# Altium schematic sheet Drone Connector.SchDoc
size A4; Organization: Altium Limited; Address1: L3, 12a Rodborough Rd; Address2: Frenchs Forest; Address3: NSW; Address4: Australia 2086; SheetNumber: 1; SheetTotal: 3
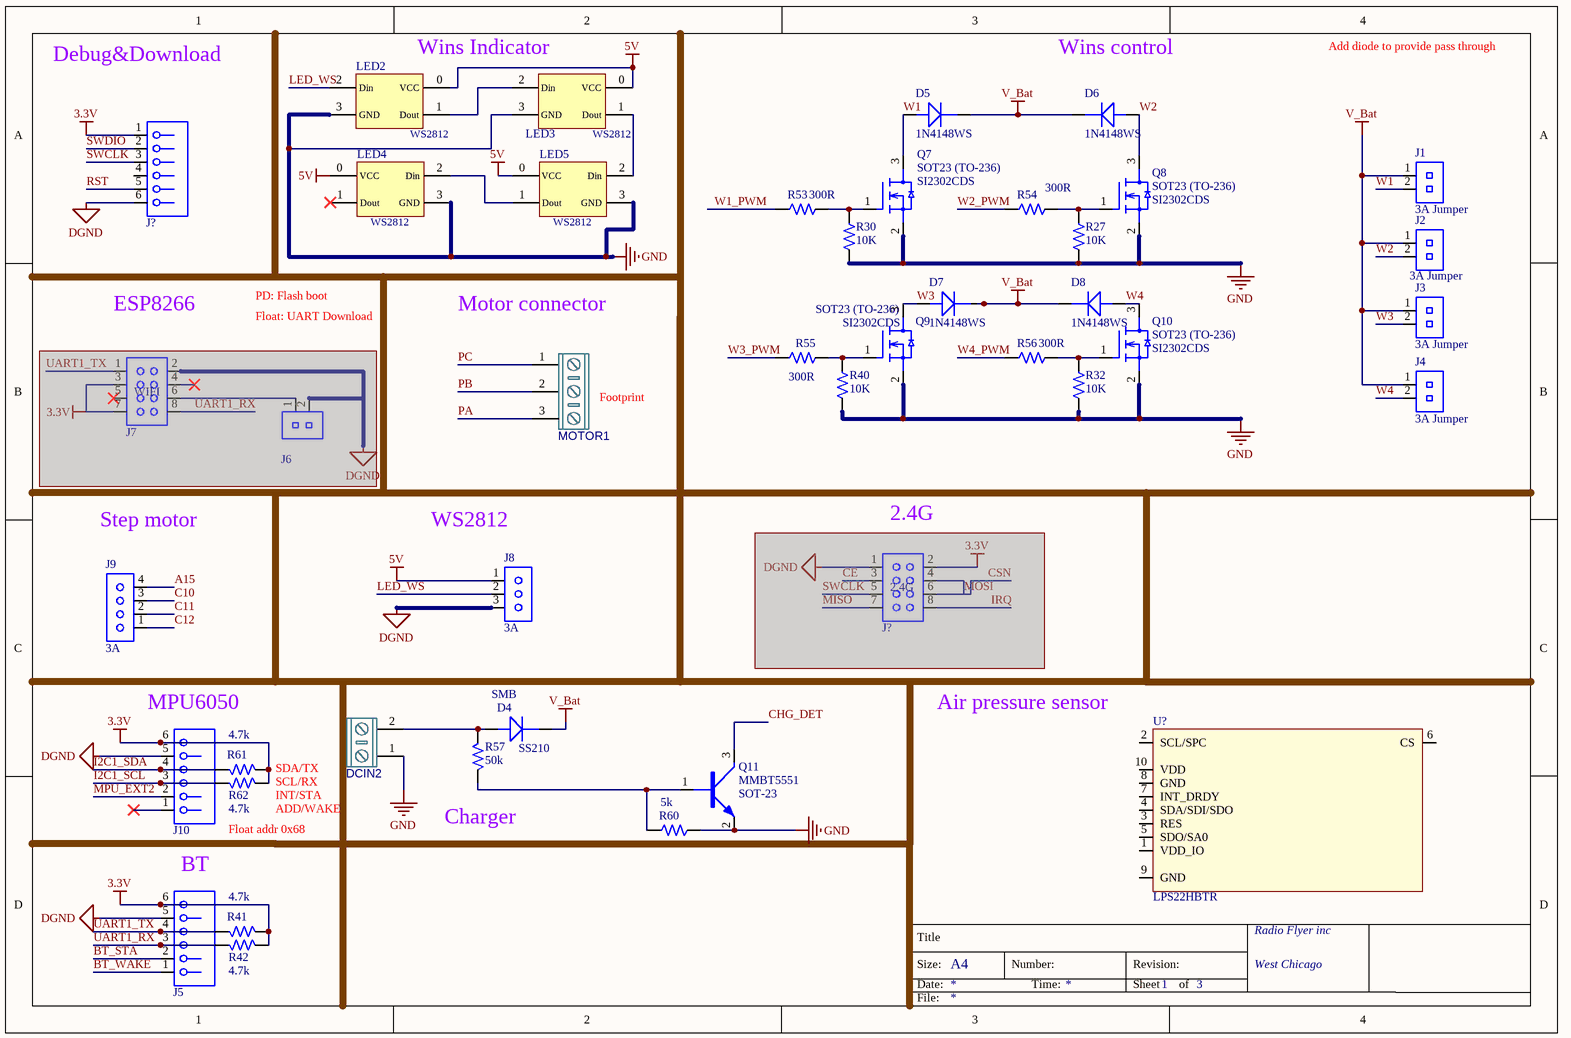
[diagram p0: Drone Connector.SchDoc]

## Parts
(Parts that share a designator on the sheet are numbered #1, #2 ... from top to bottom, then left to right.)
D4  RCD102100-0110  [SMB]  (value not drawn)
D5  RCD114148-0020  [SOD-323]  (value not drawn)
D6  RCD114148-0020  [SOD-323]  (value not drawn)
D7  RCD114148-0020  [SOD-323]  (value not drawn)
D8  RCD114148-0020  [SOD-323]  (value not drawn)
DCIN2  KF/WJ/DG 30x connecter  [KF/WJ/DG 301-2p-5.0mm]  (value not drawn)
J1  Current: 3A Jumper  [HOUSING 2P PH=2.54mm Jumper]  (hidden comment: CCH254020-0102)
J2  Current: 3A Jumper  [HOUSING 2P PH=2.54mm Jumper]  (hidden comment: CCH254020-0102)
J3  Current: 3A Jumper  [HOUSING 2P PH=2.54mm Jumper]  (hidden comment: CCH254020-0102)
J4  Current: 3A Jumper  [HOUSING 2P PH=2.54mm Jumper]  (hidden comment: CCH254020-0102)
J5  T690300121600  [CONN 6P PH=2.5mm RA XHB-6AW-KL]  (value not drawn)
J6  CCH254020-0102  [HOUSING 2P PH=2.54mm Jumper]  (value not drawn)  (masked out: inside a compile mask, not in the netlist)
J7  WIFI  [HEAD 8P 2X4 PH=2.54mm 90 H5mm_2.54-2X4AW-10.4]  (masked out: inside a compile mask, not in the netlist)
J8  Current: 3A  [HEAD 3P PH=2.54mm 180]  (hidden comment: CCP254010-0103)
J9  Current: 3A  [HEAD 4P PH=2.54mm 180]  (hidden comment: CCP254260-0104)
J10  T690300121600  [CONN 6P PH=2.5mm RA XHB-6AW-KL]  (value not drawn)
J?#1  T690300121600  [CONN 6P PH=2.5mm RA XHB-6AW-KL]  (value not drawn)
J?#2  2.4G  [HEAD 8P 2X4 PH=2.54mm 90 H5mm_2.54-2X4AW-10.4]  (masked out: inside a compile mask, not in the netlist)
LED2  WS2812  [WS2812]  (value not drawn)
LED3  WS2812  [WS2812]  (value not drawn)
LED4  WS2812  [WS2812]  (value not drawn)
LED5  WS2812  [WS2812]  (value not drawn)
MOTOR1  KF/WJ/DG 30x connecter  [KF/WJ/DG 301-3p-5.0mm]  (value not drawn)
Q7  Package: SOT23 (TO-236)  [SOT23-132-RW]  (hidden comment: SI2302CDS)
Q8  Package: SOT23 (TO-236)  [SOT23-132-RW]  (hidden comment: SI2302CDS)
Q9  Package: SOT23 (TO-236)  [SOT23-132-RW]  (hidden comment: SI2302CDS)
Q10  Package: SOT23 (TO-236)  [SOT23-132-RW]  (hidden comment: SI2302CDS)
Q11  Package: SOT-23  [SOT23-132-RW]  (hidden comment: RCN005551-0001)
R27  value 10K  [0603-RW]  (hidden comment: T5024421083A9)
R30  value 10K  [0603-RW]  (hidden comment: T5024421083A9)
R32  value 10K  [0603-RW]  (hidden comment: T5024421083A9)
R40  value 10K  [0603-RW]  (hidden comment: T5024421083A9)
R41  value 4.7k  [0603-RW]  (hidden comment: T5024421083A9)
R42  value 4.7k  [0603-RW]  (hidden comment: T5024421083A9)
R53  value 300R  [0603-RW]  (hidden comment: T5024421083A9)
R54  value 300R  [0603-RW]  (hidden comment: T5024421083A9)
R55  value 300R  [0603-RW]  (hidden comment: T5024421083A9)
R56  value 300R  [0603-RW]  (hidden comment: T5024421083A9)
R57  value 50k  [0603-RW]  (hidden comment: T5024421083A9)
R60  value 5k  [0603-RW]  (hidden comment: T5024421083A9)
R61  value 4.7k  [0603-RW]  (hidden comment: T5024421083A9)
R62  value 4.7k  [0603-RW]  (hidden comment: T5024421083A9)
U?  MFG Part: LPS22HBTR  [MSOP-10]  (hidden comment: T610300101698)

## Nets
3.3V: J5.6 J10.6 J?#1.1 R41.2 R42.2 R61.2 R62.2
5V: J8.1 LED2.0(VCC) LED3.0(VCC) LED4.0(VCC) LED5.0(VCC)
DGND: J5.5 J8.3 J10.5 J?#1.6
GND: DCIN2.1 LED2.3(GND) LED3.3(GND) LED4.3(GND) LED5.3(GND) Q7.2(S) Q8.2(S) Q9.2(S) Q10.2(S) Q11.2(E) R27.2 R30.2 R32.2 R40.2 R60.2
V_Bat: D4.2(K) D5.2(K) D6.2(K) D7.2(K) D8.2(K) J1.1 J2.1 J3.1 J4.1
A15: J9.4
BT_STA: J5.2
BT_WAKE: J5.1
C10: J9.3
C11: J9.2
C12: J9.1
CHG_DET: Q11.3(C)
I2C1_SCL: J10.3 R62.1
I2C1_SDA: J10.4 R61.1
LED_WS: J8.2 LED2.2(Din)
MPU_EXT2: J10.2
PA: MOTOR1.3
PB: MOTOR1.2
PC: MOTOR1.1
RST: J?#1.5
SWCLK: J?#1.3
SWDIO: J?#1.2
UART1_RX: J5.3 R42.1
UART1_TX: J5.4 R41.1
W1: D5.1(A) J1.2 Q7.3(D)
W1_PWM: R53.1
W2: D6.1(A) J2.2 Q8.3(D)
W2_PWM: R54.1
W3: D7.1(A) J3.2 Q9.3(D)
W3_PWM: R55.1
W4: D8.1(A) J4.2 Q10.3(D)
W4_PWM: R56.1
NetD4_1: D4.1(A) DCIN2.2 R57.1
NetLED2_1: LED2.1(Dout) LED3.2(Din)
NetLED3_1: LED3.1(Dout) LED5.2(Din)
NetLED4_2: LED4.2(Din) LED5.1(Dout)
NetQ7_1: Q7.1(G) R30.1 R53.2
NetQ8_1: Q8.1(G) R27.1 R54.2
NetQ9_1: Q9.1(G) R40.1 R55.2
NetQ10_1: Q10.1(G) R32.1 R56.2
NetQ11_1: Q11.1(B) R57.2 R60.1

Not connected (* = marked no-connect by the designer): J10 1*; J?#1 4; LED4 1(Dout)*; U? 1(VDD_IO) 2(SCL/SPC) 3(RES) 4(SDA/SDI/SDO) 5(SDO/SA0) 6(CS) 7(INT_DRDY) 8(GND) 9(GND) 10(VDD)

## Notes on the sheet
- Debug&Download
- Wins Indicator
- Wins control
- Add diode to provide pass through
- ESP8266
- PD: Flash boot
- (near MOTOR1) Motor connector
- Float: UART Download
- (near MOTOR1) Footprint
- (near J?#2) 2.4G
- Step motor
- (near J8) WS2812
- (near J10) MPU6050
- (near U?) Air pressure sensor
- SDA/TX
- SCL/RX
- Float addr 0x68
- INT/STA
- ADD/WAKE
- (near R57) Charger
- BT
- Title
- Size:
- Date:
- A4
- Number:
- Time:
- Revision:
- Sheet
- of
- Radio Flyer inc
- West Chicago
- File:

## Library data of the parts
D4 = SS210: SWITC 100V 2A SS210 MIC G; SAP: T572005362246; Vendor Name: 深圳市春明电子有限公司; Vendor Code: 10020343; Type: DIODE; Optional: USD (和572004962246 交易幣別不一樣)帋ISHIDDEN=T|IS|IS|IS|IS|IS|IS; DIP&SMD: SMD; MFG: MIC; Voltage: 100V; Current: 2A; Customer Specific: N/A; MFG Part: SS210; Package: SMB
D5-D8 = 1N4148WS: DIODE SW 1N4148 VF=0.7V SOD-323; MFG: TW SEMICONDUCTOR; SAP: T572005070208; Voltage: 100V; Current: 150MA; DIP&SMD: SMD; Vendor Name: *; Vendor Code: *; Type: DIODE; Package: SOD-323; Customer Specific: N/A; MFG Part: 1N4148WS
DCIN2 = KF/WJ/DG 30x: 接线端子 2Pin
J1-J4 = HOUSING 2P PH=2.54mm Jumper: HOUSING SIL Jumper 2P 90059-1007 Molex; Value: 2.54mm; SAP: T690300000900; Vendor Name: 深圳市利民丰电子有限公司; Vendor Code: 10020373; DIP&SMD: DIP; MFG: *; MFG Part: *; Type: Connector
J5 J10 J?#1 = CONN PH 6P PH=2.5mm RA XHB-6AW-KL: CONNECTOR 6PIN P=2.5 WHITE 90 K; Value: 2.5mm; MFG: 金佳电子; CREATE_NAME: Nathan; DIP&SMD: DIP; SAP: T690300121600; MFG Part: XHB-6AW-KL; Vendor Name: *; Vendor Code: *; Type: Connector; Current: *; CREATE_TIME: 27-Sep-2017
J6 = HOUSING 2P PH=2.54mm Jumper: HOUSING SIL Jumper 2P 90059-1007 Molex; Value: 2.54mm; SAP: T690300000900; Vendor Name: 深圳市利民丰电子有限公司; Vendor Code: 10020373; DIP&SMD: DIP; Current: 3A Jumper; MFG: *; MFG Part: *; Type: Connector
J7 J?#2 = HEAD 8P 2X4 PH=2.54mm 90 H5mm_2.54-2X4AW-10.4: 2X4P P:2.54MM 90° DIP K; Value: 2.54mm; SAP: T690300110000; MFG: JINJIA; CREATE_NAME: Nathan; MFG Part: 2.54-2X4AW-10.4; Vendor Name: *; Vendor Code: *; Type: Connector; Current: *; CREATE_TIME: 12-Sep-2017; DIP&SMD: DIP
J8 = HEAD 3P PH=2.54mm 180: HEAD PIN 3P P2.54*H11.6MM; Value: 2.54mm; SAP: T690300031100; Vendor Name: 深圳市利民丰电子有限公司; Vendor Code: 10020373; DIP&SMD: DIP; MFG: *; MFG Part: *; Type: Connector
J9 = HEAD 4P PH=2.54mm 180 H11.5mm: HEAD PIN 4P P2.54xH11.5MM; Value: 2.54mm; SAP: T690300023200; Vendor Name: 亿源电子有限公司; Vendor Code: 10009989; DIP&SMD: DIP; MFG: *; MFG Part: *; Type: Connector
MOTOR1 = KF/WJ/DG 30x-3P: 接线端子 3Pin
Q7-Q10 = SI2302CDS: NMOS FET-Si2302CDS; MFG: VISHAY; CREATE_NAME: Nathan; DIP&SMD: SMD; SAP: *; Power: *; Vendor Code: *; Vendor Name: *; Voltage: *; Current: *; Type: NMOS; CREATE_TIME: 17-Nov-2020; Customer Specific: N/A; MFG Part: SI2302CDS
Q11 = MMBT5551: XISTR NPN MMBT5551 SOT-23 FAIRCHILD; SAP: T581001790453; MFG: 宣瑜; Vendor Code: 10020343; Vendor Name: 深圳市春明电子有限公司; DIP&SMD: SMD; Power: *; Voltage: *; Type: NPN; Customer Specific: N/A; MFG Part: MMBT5551
R27 R30 R32 R40-R42 R53-R57 R60-R62 = RES0201 1/20W 1% 4.42K OHM_WALSIN: CHIP 4.42K OHM 200PPM +-1% 0201 WALS L; MFG Part: WR02X4421FAL; Power: 1/20W; MFG: WALSIN (華新); TOL: 1%; CREATE_NAME: Nathan; DIP&SMD: SMD; Vendor Code: *; SAP: T5024421083A9; Vendor Name: *; Type: Resistor; PACKAGE: 0603; CREATE_TIME: 23-July-2019; Customer Specific: N/A
U? = WT51F108S-MG10BWT: MCU WT51F108S-MG10BWT MSOP WELTREN K; MFG: Weltrend; CREATE_NAME: Nathan; DIP&SMD: SMD; Vendor Code: *; Vendor Name: *; SAP: T610300101698; Type: IC; CREATE_TIME: 04-Mar-2019; Customer Specific: N/A